# Altium schematic sheet Logic.SchDoc
size C; SheetNumber: 1; SheetTotal: 1
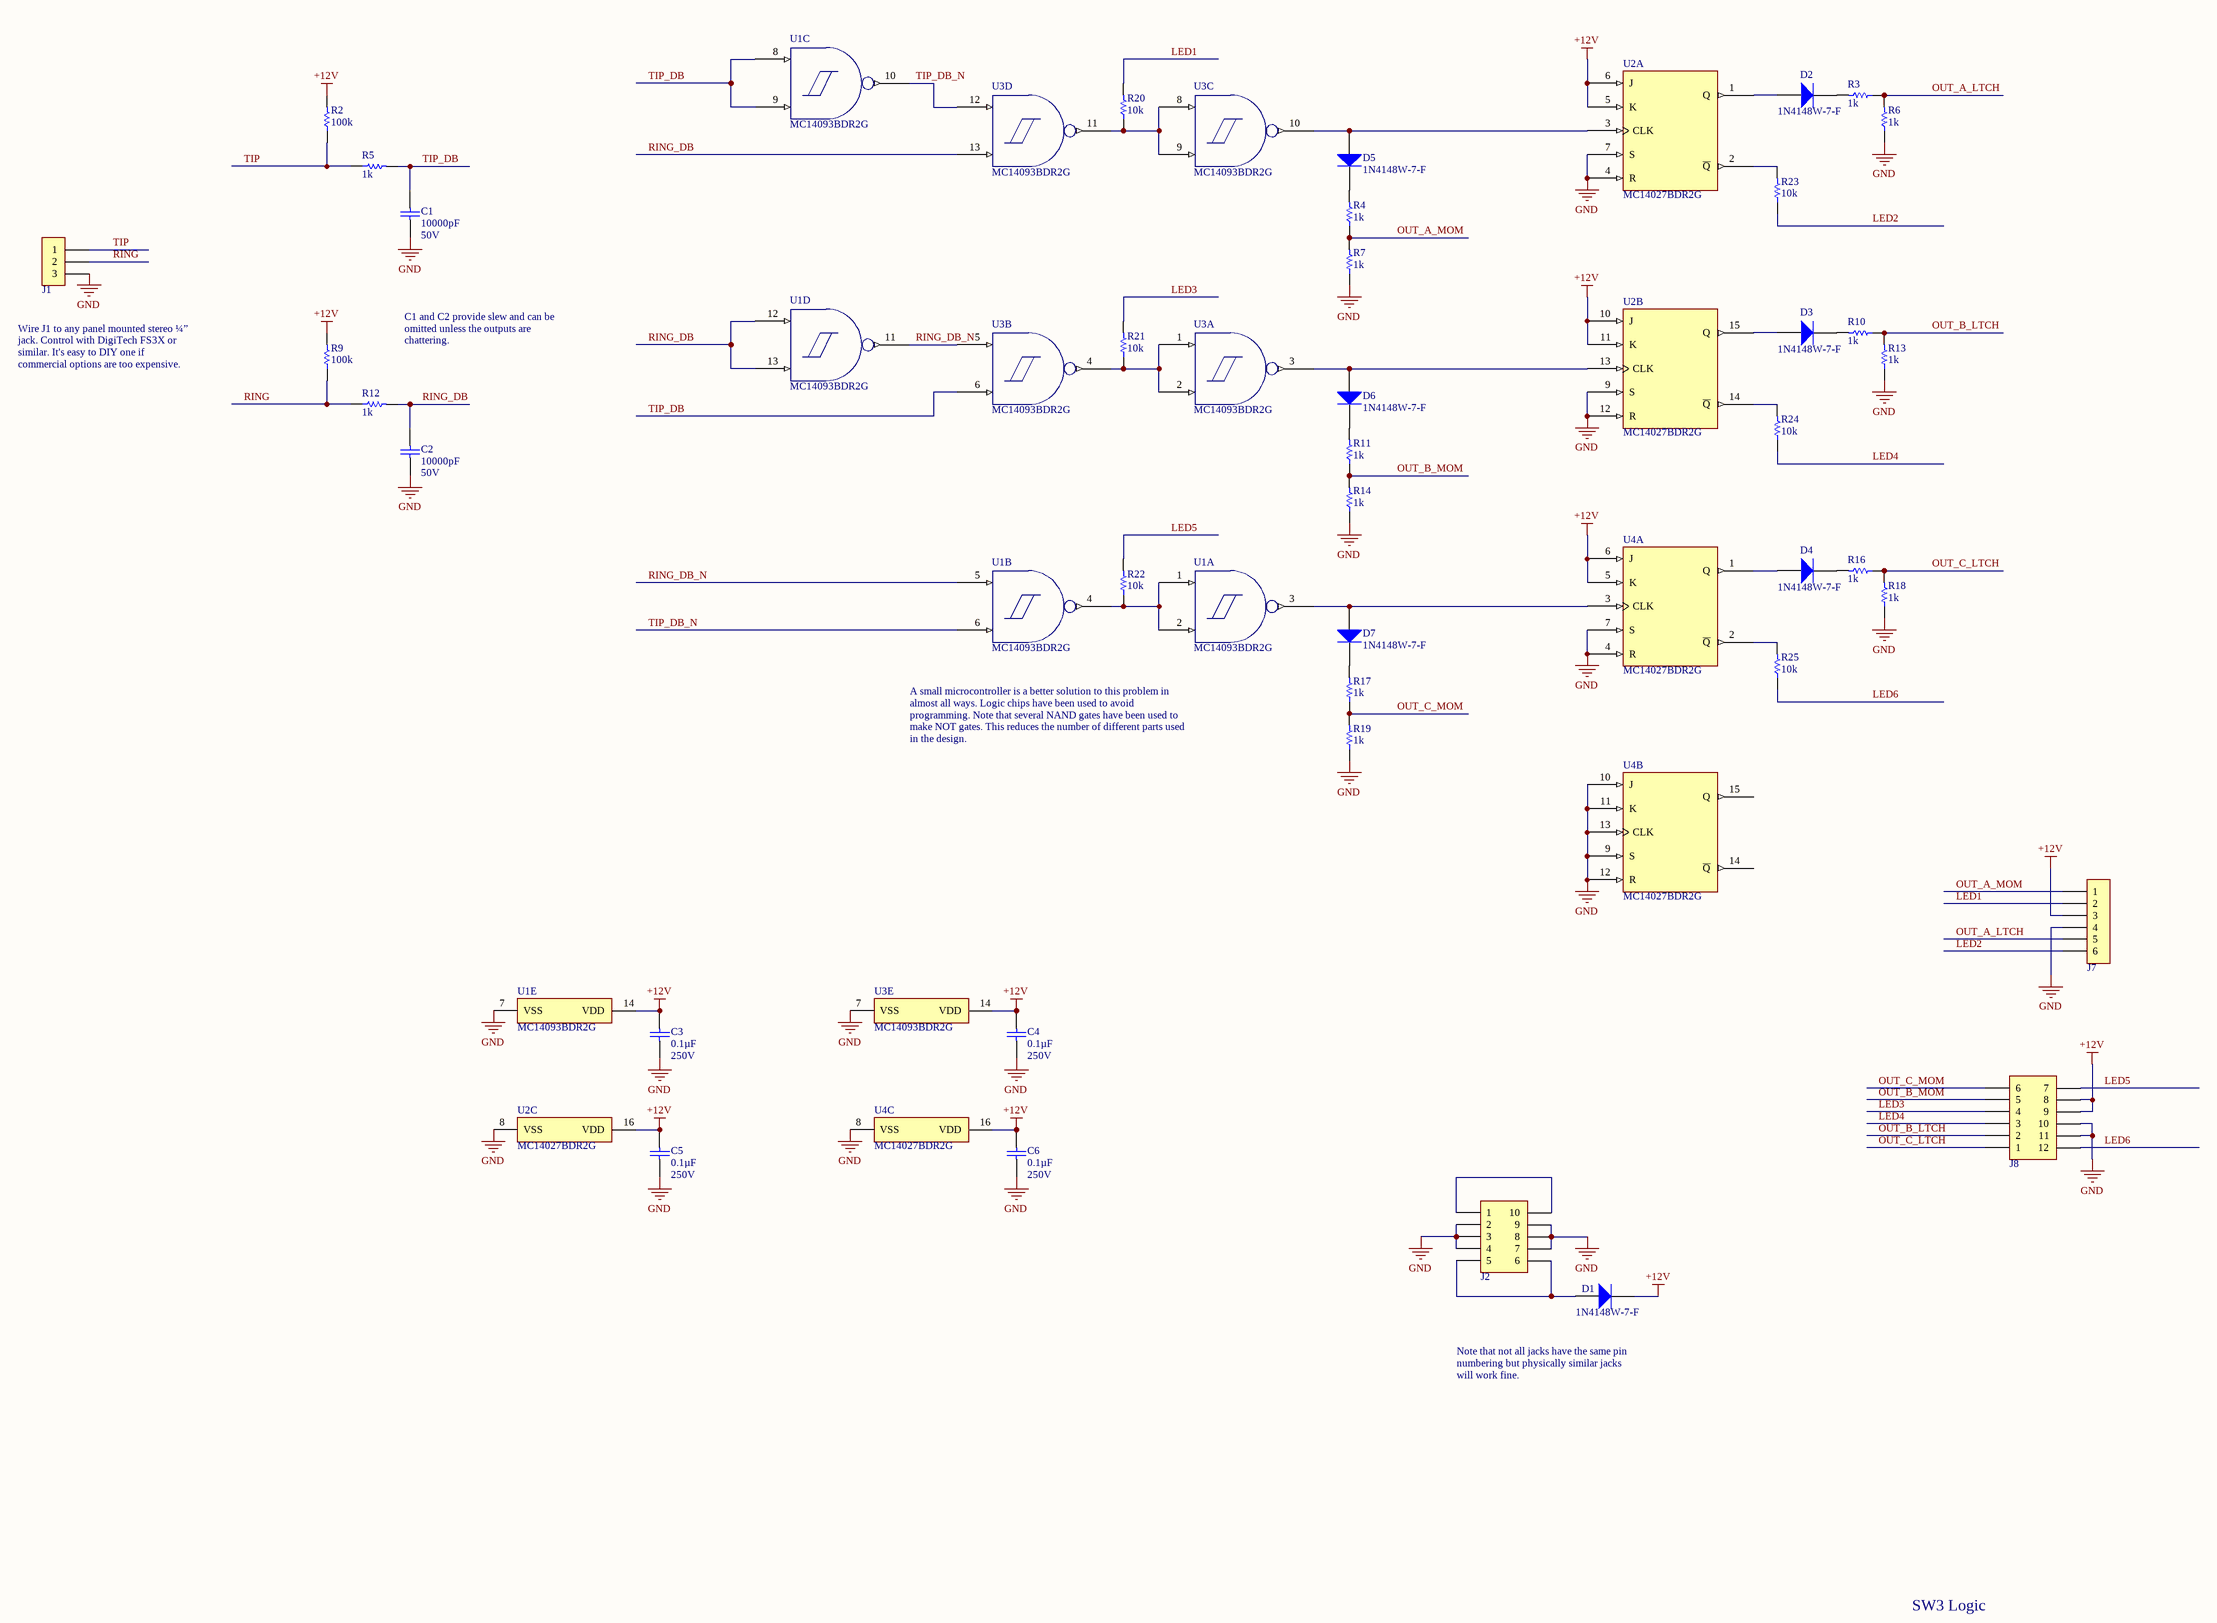
[diagram p0: Logic.SchDoc]

## Parts
C1  10000pF  Voltage: 50V  [Chip0805]
C2  10000pF  Voltage: 50V  [Chip0805]
C3  0.1µF  Voltage: 250V  [Chip0805]
C4  0.1µF  Voltage: 250V  [Chip0805]
C5  0.1µF  Voltage: 250V  [Chip0805]
C6  0.1µF  Voltage: 250V  [Chip0805]
D1  1N4148W-7-F  [SOD-123]
D2  1N4148W-7-F  [SOD-123]
D3  1N4148W-7-F  [SOD-123]
D4  1N4148W-7-F  [SOD-123]
D5  1N4148W-7-F  [SOD-123]
D6  1N4148W-7-F  [SOD-123]
D7  1N4148W-7-F  [SOD-123]
J1  3-644456-3  [TE_3-644456-3]  (value not drawn)
J2  75869-101LF  [IDC_100_2x5]  (value not drawn)
J7  535584-1  [TE_535584-1]  (value not drawn)
J8  5-534998-6  [TE_5-534998-6]  (value not drawn)
R2  100k  [Chip0805]
R3  1k  [Chip0805]
R4  1k  [Chip0805]
R5  1k  [Chip0805]
R6  1k  [Chip0805]
R7  1k  [Chip0805]
R9  100k  [Chip0805]
R10  1k  [Chip0805]
R11  1k  [Chip0805]
R12  1k  [Chip0805]
R13  1k  [Chip0805]
R14  1k  [Chip0805]
R16  1k  [Chip0805]
R17  1k  [Chip0805]
R18  1k  [Chip0805]
R19  1k  [Chip0805]
R20  10k  [Chip0805]
R21  10k  [Chip0805]
R22  10k  [Chip0805]
R23  10k  [Chip0805]
R24  10k  [Chip0805]
R25  10k  [Chip0805]
U1  MC14093BDR2G  [14-SOIC]  (parts A,B,C,D,E of 5)
U2  MC14027BDR2G  [16-SOIC]  (parts A,B,C of 3)
U3  MC14093BDR2G  [14-SOIC]  (parts A,B,C,D,E of 5)
U4  MC14027BDR2G  [16-SOIC]  (parts A,B,C of 3)

## Nets
+12V: C3.2 C4.2 C5.2 C6.2 D1.1(C) J7.3 J8.8 J8.9 R2.2 R9.2 U1.14(VDD) U2.5(K) U2.6(J) U2.10(J) U2.11(K) U2.16(VDD) U3.14(VDD) U4.5(K) U4.6(J) U4.16(VDD)
GND: C1.1 C2.1 C3.1 C4.1 C5.1 C6.1 J1.3 J2.2 J2.3 J2.4 J2.7 J2.8 J2.9 J7.4 J8.10 J8.11 R6.1 R7.1 R13.1 R14.1 R18.1 R19.1 U1.7(VSS) U2.4(R) U2.7(S) U2.8(VSS) U2.9(S) U2.12(R) U3.7(VSS) U4.4(R) U4.7(S) U4.8(VSS) U4.9(S) U4.10(J) U4.11(K) U4.12(R) U4.13(CLK)
LED1: J7.2 R20.2
LED2: J7.6 R23.1
LED3: J8.4 R21.2
LED4: J8.3 R24.1
LED5: J8.7 R22.2
LED6: J8.12 R25.1
OUT_A_LTCH: J7.5 R3.1 R6.2
OUT_A_MOM: J7.1 R4.1 R7.2
OUT_B_LTCH: J8.2 R10.1 R13.2
OUT_B_MOM: J8.5 R11.1 R14.2
OUT_C_LTCH: J8.1 R16.1 R18.2
OUT_C_MOM: J8.6 R17.1 R19.2
RING: J1.2 R9.1 R12.1
RING_DB: C2.2 R12.2 U1.12 U1.13 U3.13
RING_DB_N: U1.5 U1.11 U3.5
TIP: J1.1 R2.1 R5.1
TIP_DB: C1.2 R5.2 U1.8 U1.9 U3.6
TIP_DB_N: U1.6 U1.10 U3.12
NetD1_2: D1.2(A) J2.5 J2.6
NetD2_1: D2.1(C) R3.2
NetD2_2: D2.2(A) U2.1(Q)
NetD3_1: D3.1(C) R10.2
NetD3_2: D3.2(A) U2.15(Q)
NetD4_1: D4.1(C) R16.2
NetD4_2: D4.2(A) U4.1(Q)
NetD5_1: D5.1(C) R4.2
NetD5_2: D5.2(A) U2.3(CLK) U3.10
NetD6_1: D6.1(C) R11.2
NetD6_2: D6.2(A) U2.13(CLK) U3.3
NetD7_1: D7.1(C) R17.2
NetD7_2: D7.2(A) U1.3 U4.3(CLK)
NetJ2_1: J2.1 J2.10
NetR20_1: R20.1 U3.8 U3.9 U3.11
NetR21_1: R21.1 U3.1 U3.2 U3.4
NetR22_1: R22.1 U1.1 U1.2 U1.4
NetR23_2: R23.2 U2.2(~{Q})
NetR24_2: R24.2 U2.14(~{Q})
NetR25_2: R25.2 U4.2(~{Q})

Not connected (* = marked no-connect by the designer): U4 14(~{Q}) 15(Q)

## Notes on the sheet
- Wire J1 to any panel mounted stereo ¼” jack. Control with DigiTech FS3X or similar. It's easy to DIY one if commercial options are too expensive.
- C1 and C2 provide slew and can be omitted unless the outputs are chattering.
- A small microcontroller is a better solution to this problem in almost all ways. Logic chips have been used to avoid programming. Note that several NAND gates have been used to make NOT gates. This reduces the number of different parts used in the design.
- Note that not all jacks have the same pin numbering but physically similar jacks will work fine.
- SW3 Logic
- Title:
- This work is licensed under a Creative Commons Attribution 4.0 International License. Derivative works should remove all Sophistry branding and ‘é’ watermark.
- Date:
- Engineer:
- Revision:
- Codename:
- Time:
- Variant:
- Sheet
- of

## Library data of the parts
C1 C2 = C2012C0G1H103J060AA: CAP CER 10000PF 50V 5% NP0 0805; Manufacturer: TDK Corporation; Temperature Coefficient: C0G, NP0; PartNumber: C2012C0G1H103J060AA; HelpURL: http://product.tdk.com/capacitor/mlcc/en/documents/mlcc_commercial_general_en.pdf; Supplier 1: Digi-Key; Supplier Part Number 1: 445-7519-1-ND; Supplier 2: Mouser; Manufacturer Part Number: C2012C0G1H103J060AA; Series: C; Capacitance: 10000pF; Tolerance: ±5%; Mounting Type: Surface Mount, MLCC; Operating Temperature: -55°C ~ 125°C; Applications: General Purpose; Ratings: -; Package / Case: 0805 (2012 Metric); Size / Dimension: 0.079" L x 0.049" W (2.00mm x 1.25mm); Height - Seated (Max): -; Thickness (Max): 0.028" (0.70mm); Lead Spacing: -; Features: -; Lead Style: -
C3-C6 = C2012X7T2E104K125AA: CAP CER 0.1UF 250V 10% X7T 0805; Manufacturer: TDK Corporation; PartNumber: C2012X7T2E104K125AA; HelpURL: http://product.tdk.com/capacitor/mlcc/en/documents/mlcc_commercial_midvoltage_en.pdf; Supplier 1: Digi-Key; Supplier Part Number 1: 445-7749-1-ND; Supplier 2: Mouser; Manufacturer Part Number: C2012X7T2E104K125AA; Series: C; Capacitance: 0.1µF; Tolerance: ±10%; Temperature Coefficient: X7T; Mounting Type: Surface Mount, MLCC; Operating Temperature: -55°C ~ 125°C; Applications: General Purpose; Ratings: -; Package / Case: 0805 (2012 Metric); Size / Dimension: 0.079" L x 0.049" W (2.00mm x 1.25mm); Height - Seated (Max): -; Thickness (Max): 0.057" (1.45mm); Lead Spacing: -; Features: -; Lead Style: -
D1-D7 = 1N4148W-7-F: DIODE SWITCH 100V 0.15A SOD123; Manufacturer: Diodes Incorporated; Diode Type: Standard; Current - Average Rectified (Io): 150mA; Voltage - Forward (Vf) (Max) @ If: 1.25V @ 150mA; Speed: Small Signal =< 200mA (Io), Any Speed; Reverse Recovery Time (trr): 4ns; Current - Reverse Leakage @ Vr: 1µA @ 75V; Capacitance @ Vr, F: 2pF @ 0V, 1MHz; PartNumber: 1N4148W-7-F; Datasheets: http://www.diodes.com/datasheets/ds30086.pdf; Supplier 1: Digi-Key; Supplier Part Number 1: 1N4148W-FDICT-ND; Manufacturer Part Number: 1N4148W-7-F; Series: 0; Voltage - DC Reverse (Vr) (Max): 100V; Mounting Type: Surface Mount; Package / Case: SOD-123; Supplier Device Package: SOD-123; Operating Temperature - Junction: -65°C ~ 150°C
J1 = 3-644456-3: CONN HEADER VERT 3POS .100 TIN; Manufacturer: TE Connectivity; Connector Type: Header, Unshrouded; Number of Positions: 3; Number of Positions Loaded: All; Pitch: 0.100" (2.54mm); PartNumber: 3-644456-3; Supplier 1: Digi-Key; Supplier 2: Mouser; Supplier Part Number 2: 571-3-644456-3; HelpURL: http://www.te.com/commerce/DocumentDelivery/DDEController?Action=srchrtrv&DocNm=644456&DocType=Customer+Drawing&DocLang=English; Supplier Part Number 1: A31113-ND; Manufacturer Part Number: 3-644456-3; Series: MTA-100, AMP; Contact Type: Male Pin; Number of Rows: 1; Row Spacing: -; Contact Mating Length: 0.295" (7.49mm); Mounting Type: Through Hole; Termination: Solder; Fastening Type: -; Features: -; Contact Finish: Tin; Contact Finish Thickness: 150µin (3.81µm); Color: Natural
J2 = 75869-101LF: CONN HEADER 10POS DUAL VERT PCB; Manufacturer: FCI; Connector Type: Header, Shrouded; Number of Positions: 10; Number of Positions Loaded: All; Pitch: 0.100" (2.54mm); PartNumber: 75869-101LF; Supplier 1: Digi-Key; Supplier 2: Mouser; Supplier Part Number 2: 649-75869-101LF; HelpURL: http://portal.fciconnect.com/Comergent//fci/drawing/75869.pdf; Supplier Part Number 1: 609-1774-ND; Manufacturer Part Number: 75869-101LF; Series: Quickie™, Basics+; Contact Type: Male Pin; Number of Rows: 2; Row Spacing: 0.100" (2.54mm); Contact Mating Length: 0.236" (6.00mm); Mounting Type: Through Hole; Termination: Solder; Fastening Type: -; Features: -; Contact Finish: Gold, GXT™; Contact Finish Thickness: 30µin (0.76µm); Color: Blue
J7 = 535584-1: CONN RECEPT 6POS .100 VERT; Manufacturer: TE Connectivity AMP Connectors; PartNumber: 535584-1; HelpURL: https://www.te.com/commerce/DocumentDelivery/DDEController?Action=srchrtrv&DocNm=535584&DocType=Customer+Drawing&DocLang=English; Supplier 1: Digi-Key; Supplier Part Number 1: A115379-ND; Supplier 2: Mouser; Supplier Part Number 2: 571-535584-1; Manufacturer Part Number: 535584-1
J8 = 5-534998-6: CONN RECEPT 12POS .100 VERT DUAL; Manufacturer: TE Connectivity AMP Connectors; Connector Type: Receptacle, Bottom or Top Entry; Number of Positions: 12; Number of Positions Loaded: All; Pitch: 0.100" (2.54mm); PartNumber: 5-534998-6; HelpURL: http://www.te.com/commerce/DocumentDelivery/DDEController?Action=srchrtrv&DocNm=534998&DocType=Customer+Drawing&DocLang=English; Supplier 1: Digi-Key; Supplier Part Number 1: A32956-ND; Supplier 2: Mouser; Supplier Part Number 2: 571-5-534998-6; Manufacturer Part Number: 5-534998-6; Series: AMPMODU Mod IV; Contact Type: Female Socket; Number of Rows: 2; Row Spacing: 0.100" (2.54mm); Mounting Type: Through Hole; Termination: Solder; Fastening Type: -; Features: -; Contact Finish: Gold; Contact Finish Thickness: 30µin (0.76µm); Color: Black
R2 R9 = CRCW0805100KFKEA: RES 100K OHM 1/8W 1% 0805 SMD; Manufacturer: Vishay Dale; Power (Watts): 0.125W, 1/8W; Temperature Coefficient: ±100ppm/°C; PartNumber: CRCW0805100KFKEA; HelpURL: http://www.vishay.com/doc?20035; Supplier 1: Digi-Key; Supplier Part Number 1: 541-100KCCT-ND; Supplier 2: Mouser; Manufacturer Part Number: CRCW0805100KFKEA; Series: CRCW; Resistance: 100k; Tolerance: ±1%; Composition: Thick Film; Features: Automotive AEC-Q200 Qualified; Package / Case: 0805 (2012 Metric); Supplier Device Package: 0805 (2012 Metric); Size / Dimension: 0.079" L x 0.049" W (2.00mm x 1.25mm); Height: 0.020" (0.50mm); Number of Terminations: 2
R3-R7 R10-R14 R16-R19 = CRCW08051K00FKEA: RES 1.00K OHM 1/8W 1% 0805 SMD; Manufacturer: Vishay Dale; Power (Watts): 0.125W, 1/8W; Temperature Coefficient: ±100ppm/°C; PartNumber: CRCW08051K00FKEA; HelpURL: http://www.vishay.com/doc?20035; Supplier 1: Digi-Key; Supplier Part Number 1: 541-1.00KCCT-ND; Supplier 2: Mouser; Manufacturer Part Number: CRCW08051K00FKEA; Series: CRCW; Resistance: 1k; Tolerance: ±1%; Composition: Thick Film; Features: Automotive AEC-Q200 Qualified; Package / Case: 0805 (2012 Metric); Supplier Device Package: 0805 (2012 Metric); Size / Dimension: 0.079" L x 0.049" W (2.00mm x 1.25mm); Height: 0.020" (0.50mm); Number of Terminations: 2
R20-R25 = CRCW080510K0FKEA: RES 10.0K OHM 1/8W 1% 0805 SMD; Manufacturer: Vishay Dale; Power (Watts): 0.125W, 1/8W; Temperature Coefficient: ±100ppm/°C; PartNumber: CRCW080510K0FKEA; HelpURL: http://www.vishay.com/doc?20035; Supplier 1: Digi-Key; Supplier Part Number 1: 541-10.0KCCT-ND; Supplier 2: Mouser; Manufacturer Part Number: CRCW080510K0FKEA; Series: CRCW; Resistance: 10k; Tolerance: ±1%; Composition: Thick Film; Features: Automotive AEC-Q200 Qualified; Package / Case: 0805 (2012 Metric); Supplier Device Package: 0805 (2012 Metric); Size / Dimension: 0.079" L x 0.049" W (2.00mm x 1.25mm); Height: 0.020" (0.50mm); Number of Terminations: 2
U1 U3 = MC14093BDR2G: IC GATE NAND 4CH 2-INP 14SOIC; Manufacturer: onsemi; PartNumber: MC14093BDR2G; Supplier 1: Digi-Key; Supplier 2: Mouser; Supplier Part Number 2: 863-MC14093BDR2G; HelpURL: https://www.onsemi.com/pdf/datasheet/mc14093b-d.pdf; Supplier Part Number 1: MC14093BDR2GOSCT-ND; Manufacturer Part Number: MC14093BDR2G
U2 U4 = MC14027BDR2G: IC FF JK TYPE DUAL 1BIT 16SOIC; Manufacturer: onsemi; PartNumber: MC14027BDR2G; Supplier 1: Digi-Key; Supplier 2: Mouser; Supplier Part Number 2: 863-MC14027BDR2G; HelpURL: https://www.onsemi.com/pdf/datasheet/mc14027b-d.pdf; Supplier Part Number 1: MC14027BDR2GOSTR-ND; Manufacturer Part Number: MC14027BDR2G